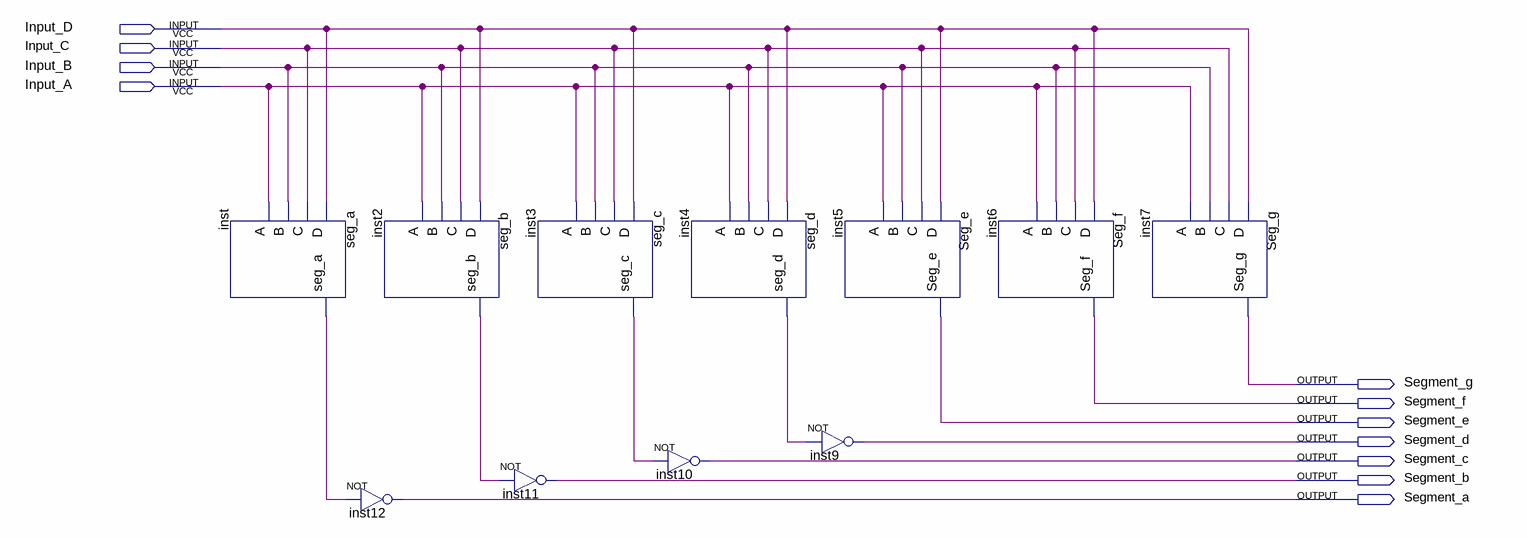
[diagram p0: schematic sheet]
// Quartus schematic 7_Seg.bdf as structural Verilog: 11 symbols, 11 pins
module \7_Seg  (
  input  Input_D,
  input  Input_C,
  input  Input_B,
  input  Input_A,
  output Segment_g,
  output Segment_f,
  output Segment_e,
  output Segment_d,
  output Segment_c,
  output Segment_b,
  output Segment_a
);

  wire inst2_seg_b, inst3_seg_c, inst4_seg_d, inst_seg_a;

  seg_a inst (.D(Input_D), .C(Input_C), .B(Input_B), .A(Input_A), .seg_a(inst_seg_a));
  not inst12 (Segment_a, inst_seg_a);
  seg_b inst2 (.D(Input_D), .C(Input_C), .B(Input_B), .A(Input_A), .seg_b(inst2_seg_b));
  not inst11 (Segment_b, inst2_seg_b);
  seg_c inst3 (.D(Input_D), .C(Input_C), .B(Input_B), .A(Input_A), .seg_c(inst3_seg_c));
  not inst10 (Segment_c, inst3_seg_c);
  seg_d inst4 (.D(Input_D), .C(Input_C), .B(Input_B), .A(Input_A), .seg_d(inst4_seg_d));
  not inst9 (Segment_d, inst4_seg_d);
  Seg_e inst5 (.D(Input_D), .C(Input_C), .B(Input_B), .A(Input_A), .Seg_e(Segment_e));
  Seg_f inst6 (.D(Input_D), .C(Input_C), .B(Input_B), .A(Input_A), .Seg_f(Segment_f));
  Seg_g inst7 (.D(Input_D), .C(Input_C), .B(Input_B), .A(Input_A), .Seg_g(Segment_g));
endmodule
